# EAGLE design 4069-Twin-T-Drums-PinConn-alt (EAGLE 7.2.0)
Twin-T Analog Drum Voice using CD40106
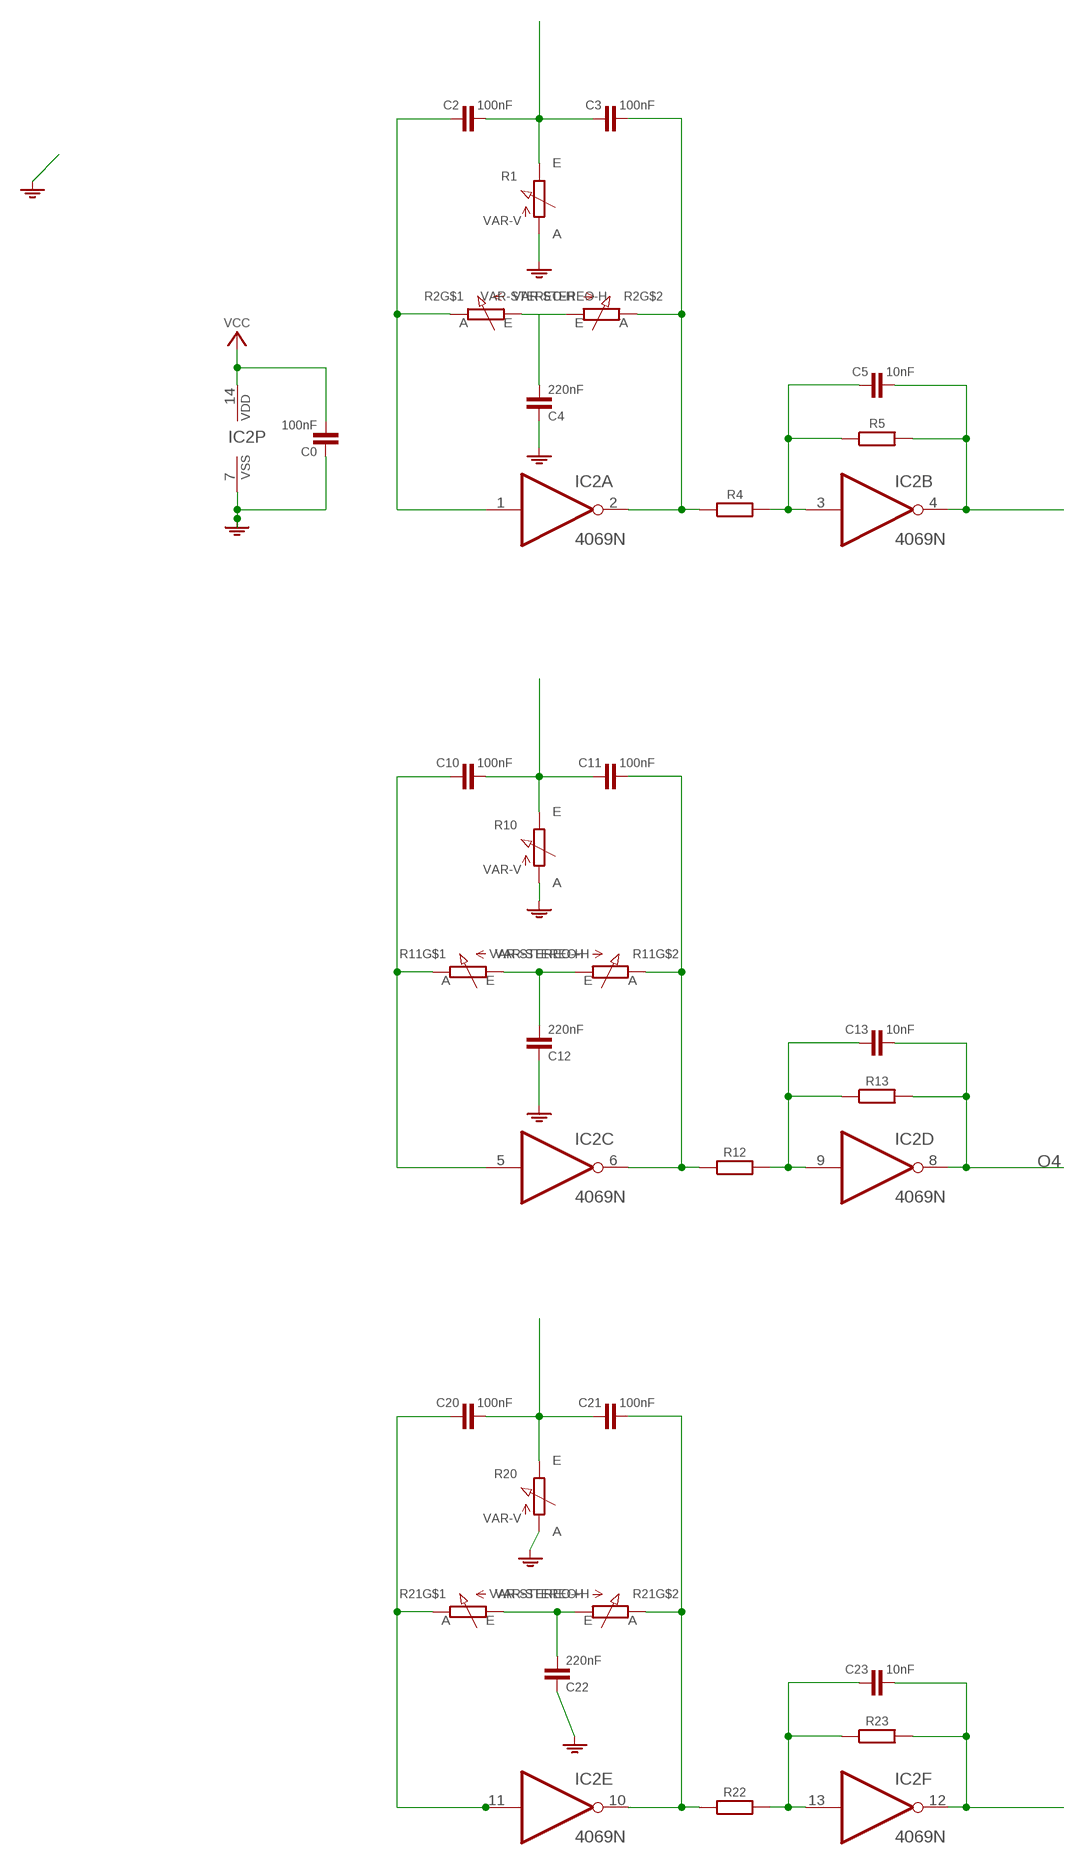
[diagram p0: schematic, sheet 1]

## Parts
C0  100nF  C050-020X044/V  [C050-020X044/V]
C2  100nF  C-H050-020X044  [C050-020X044]
C3  100nF  C-H050-020X044  [C050-020X044]
C4  220nF  C050-020X044/V  [C050-020X044/V]
C5  10nF  C-H025-015X024  [C025-015X024]
C10  100nF  C-H050-020X044  [C050-020X044]
C11  100nF  C-H050-020X044  [C050-020X044]
C12  220nF  C050-020X044/V  [C050-020X044/V]
C13  10nF  C-H025-015X024  [C025-015X024]
C20  100nF  C-H050-020X044  [C050-020X044]
C21  100nF  C-H050-020X044  [C050-020X044]
C22  220nF  C050-020X044/V  [C050-020X044/V]
C23  10nF  C-H025-015X024  [C025-015X024]
IC2  4069N  [DIL14]
R1  VAR-V  [CONN-2P]
R2  VAR-STEREO-H  [CONN-2X2]
R4  R-H0202/2V  [0202/2V]
R5  R-H0202/2V  [0202/2V]
R10  VAR-V  [CONN-2P]
R11  VAR-STEREO-H  [CONN-2X2]
R12  R-H0204/10  [0204/10]
R13  R-H0202/2V  [0202/2V]
R20  VAR-V  [CONN-2P]
R21  VAR-STEREO-H  [CONN-2X2]
R22  R-H0204/10-V  [0204/10-V]
R23  R-H0202/2V  [0202/2V]
S12  VCC_GNDPWR-L  [PWR-L]

## Nets
DR1: C4.2 R2.1(A) R2.3(A)
GND: C0.1 C4.1 C12.1 C22.1 IC2.7(P:VSS) R1.1(A) R10.1(A) R20.1(A) S12.1
I1: C2.1 IC2.1(A:I) R2.2(S-A)
I2: C5.1 IC2.3(B:I) R4.2 R5.1
I3: C10.1 IC2.5(C:I) R11.2(S-A)
I4: C13.1 IC2.9(D:I) R12.2 R13.1
I5: C20.1 IC2.11(E:I) R21.2(S-A)
I6: C23.1 IC2.13(F:I) R22.2 R23.1
N$1: C12.2 R11.1(A) R11.3(A)
N$2: C22.2 R21.1(A) R21.3(A)
O1: C3.2 IC2.2(A:O) R2.4(S-A) R4.1
O2: C5.2 IC2.4(B:O) R5.2
O3: C11.2 IC2.6(C:O) R11.4(S-A) R12.1
O4: C13.2 IC2.8(D:O) R13.2
O5: C21.2 IC2.10(E:O) R21.4(S-A) R22.1
O6: C23.2 IC2.12(F:O) R23.2
TR1: C2.2 C3.1 R1.2(S-E)
TR2: C10.2 C11.1 R10.2(S-E)
TR3: C20.2 C21.1 R20.2(S-E)
VCC: C0.2 IC2.14(P:VDD) S12.2

## Library data of the parts
C0 C4 C12 C22 = c:C: CAPACITOR, European symbol
C2 C3 C5 C10 C11 C13 C20 C21 C23 = c:C-H
IC2 = ic:4069: Hex INVERTER
R1 R10 R20 = r:VAR-V
R2 R11 R21 = r:VAR-STEREO-H
R4 R5 R12 R13 R22 R23 = r:R-H
S12 = pad:VCC_GND

## Net classes
0 default: width 0.61 mm, clearance 0.305 mm

## Board
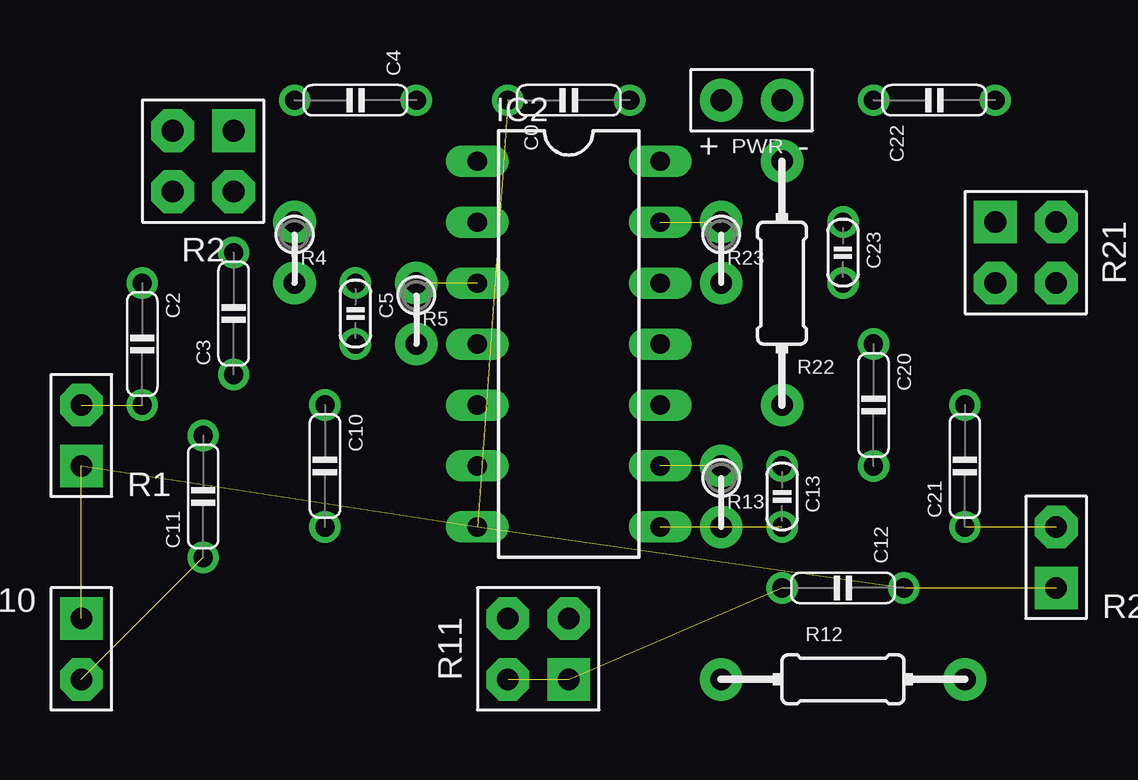
[diagram p1: board, top side]
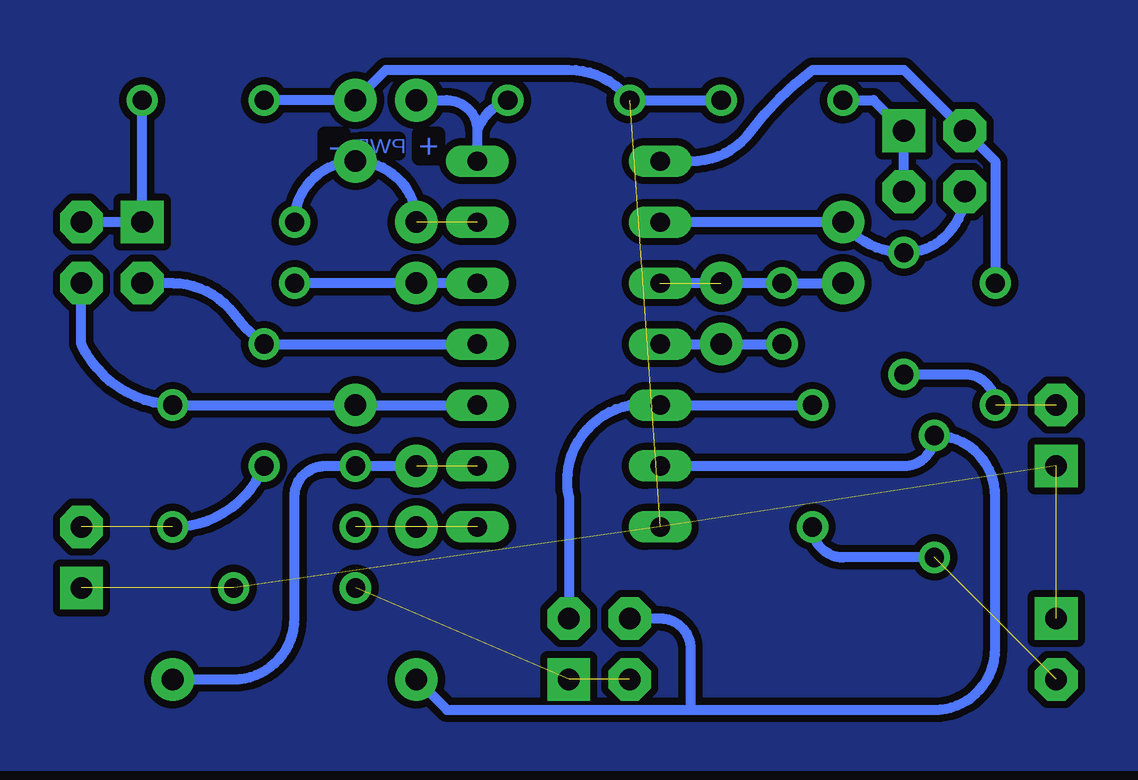
[diagram p2: board, bottom side, seen from below]

No outline drawn. Coordinates in mm, seen from the top.
Copper layers (1*16): Top 0.035mm / dielectric 1.5mm / Bottom 0.035mm
Design rules "default": minimum track width 10mil, minimum drill 24mil, track to track 8mil, track to pad 8mil, pad to pad 8mil, via to via 8mil, smd to smd 8mil, copper to edge 40mil, drill to drill 8mil, minimum pad ring 10mil, minimum via ring 8mil, stop-mask expansion 4mil, vias tented up to drill 0mil, thermal gap 10mil

### Footprints (pad centres in the part's own frame; a part is rotated, then mirrored left to right if it is on the bottom)
C050-020X044/V = drill 0.8: 1 0,2.54; 2 0,-2.54
C050-020X044 = drill 0.8: 1 -2.54,0; 2 2.54,0
C025-015X024 = drill 0.8: 1 -1.27,0; 2 1.27,0
DIL14 = drill 0.8 long: 1 -3.81,7.62; 2 -3.81,5.08; 3 -3.81,2.54; 4 -3.81,0; 5 -3.81,-2.54; 6 -3.81,-5.08; 7 -3.81,-7.62; 8 3.81,-7.62; 9 3.81,-5.08; 10 3.81,-2.54; 11 3.81,0; 12 3.81,2.54; 13 3.81,5.08; 14 3.81,7.62
CONN-2P = drill 0.9 pad 1.778 square: 1 0,-1.27 | drill 0.9 pad 1.778 octagon: 2 0,1.27
CONN-2X2 = drill 0.9 pad 1.778 square: 1 0,0 | drill 0.9 pad 1.778 octagon: 2 2.54,0; 3 0,2.54; 4 2.54,2.54
0202/2V = drill 0.9 pad 1.778: 1 0,-1.27; 2 0,1.27
0204/10 = drill 0.9 pad 1.778: 1 -5.08,0; 2 5.08,0
0204/10-V = drill 0.9 pad 1.778: 1 0,5.08; 2 0,-5.08
PWR-L = drill 0.9 pad 1.778: 1 0,0; 2 0,2.54

### Placement (x,y rotation side)
C0  31.75,38.1 90 top
C2  13.97,27.94 270 top
C3  17.78,29.21 90 top
C4  22.86,38.1 270 top
C5  22.86,29.21 270 top
C10  21.59,22.86 270 top
C11  16.51,21.59 90 top
C12  43.18,17.78 270 top
C13  40.64,21.59 270 top
C20  44.45,25.4 270 top
C21  48.26,22.86 90 top
C22  46.99,38.1 90 top
C23  43.18,31.75 270 top
IC2  31.75,27.94 0 top
R1  11.43,24.13 0 top
R2  17.78,36.83 180 top
R4  20.32,31.75 180 top
R5  25.4,29.21 180 top
R10  11.43,15.24 180 top
R11  31.75,13.97 90 top
R12  43.18,13.97 0 top
R13  38.1,21.59 180 top
R20  52.07,19.05 0 top
R21  49.53,33.02 270 top
R22  40.64,30.48 180 top
R23  38.1,31.75 180 top
S12  40.64,38.1 90 top

### Tracks (layer width: path | path; a pad name or v marks a point on that pad's centre or on a via)
DR1
  Bottom 0.406: C4.2 19.05,38.1 R2.1 R2.3
GND  (5 unrouted)
  Bottom 0.406: C22.1 S12.1 39.37,39.37 31.75,39.37 arc53 C0.1 C4.1
I1
  Bottom 0.406: IC2.1 26.67,35.56 arc-53 24.13,36.83 arc16 21.59,39.37 17.78,39.37 R2.2 13.97,35.56 C2.1
I2  (1 unrouted)
  Bottom 0.406: R4.2 C5.1 IC2.3
I3
  Bottom 0.406: C10.1 IC2.5 29.21,25.4 arc-90 31.75,21.59 R11.2
I4  (1 unrouted)
  Bottom 0.406: R12.2 45.72,13.97 arc-90 43.18,16.51 43.18,21.59 arc90 41.91,22.86 C13.1 R13.1
I5
  Bottom 0.406: IC2.11 C20.1 arc16 45.72,29.21 arc-53 48.26,30.48 R21.2
I6  (1 unrouted)
  Bottom 0.406: C23.1 arc90 R22.2 arc90 R23.1
N$1  (2 unrouted)
N$2
  Bottom 0.406: R21.3 R21.1 C22.2
N$3
  pour Bottom: 7.62,43.18 7.62,10.16 55.88,10.16 55.88,43.18
O1
  Bottom 0.406: IC2.2 R4.1 arc-53 C3.2 arc-90 R2.4
O2
  Bottom 0.406: IC2.4 R5.2 C5.2
O3
  Bottom 0.406: R12.1 36.83,12.7 26.67,12.7 | IC2.6 17.78,22.86 arc-90 C11.2 arc90 13.97,21.59 13.97,15.24 arc90 16.51,12.7 26.67,12.7 | R11.4 27.94,16.51 arc90 26.67,15.24 26.67,12.7
O4  (2 unrouted)
O5
  Bottom 0.406: IC2.10 R22.1 C21.2 arc62 52.07,27.94 R21.4
O6
  Bottom 0.406: IC2.12 R23.2 C23.2
TR1  (1 unrouted)
  Bottom 0.406: C2.2 arc-90 15.24,26.67 C3.1
TR2  (1 unrouted)
  Bottom 0.406: C11.1 20.32,19.05 arc90 C10.2
TR3  (1 unrouted)
  Bottom 0.406: C21.1 arc-67 C20.2
VCC
  Bottom 0.406: IC2.14 35.56,36.83 | 35.56,36.83 arc53 C0.2 | S12.2 36.83,38.1 arc90 35.56,36.83